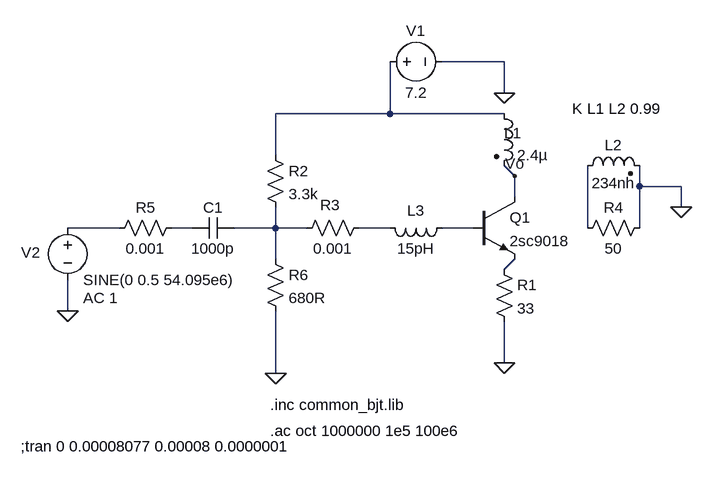
[diagram p0: schematic 27Mhz-class A.asc]
27Mhz-class A.asc, the LTspice schematic file:
Version 4
SHEET 1 880 680
WIRE 368 -112 272 -112
WIRE 368 -64 368 -112
WIRE 192 -32 192 -112
WIRE 192 -32 16 -32
WIRE 368 -32 192 -32
WIRE 16 32 16 -32
WIRE 384 64 368 48
WIRE 576 80 576 48
WIRE 640 80 576 80
WIRE 384 96 384 64
WIRE 640 112 640 80
WIRE -224 144 -304 144
WIRE -112 144 -144 144
WIRE 16 144 16 112
WIRE 16 144 -48 144
WIRE 64 144 16 144
WIRE 192 144 144 144
WIRE 320 144 272 144
WIRE 496 144 496 48
WIRE 576 144 576 80
WIRE 16 192 16 144
WIRE 368 208 384 192
WIRE -304 272 -304 224
WIRE 368 352 368 288
WIRE 16 368 16 272
FLAG 368 352 0
FLAG 368 -64 0
FLAG -304 272 0
FLAG 384 64 Vo
FLAG 16 368 0
FLAG 640 112 0
SYMBOL res 352 192 R0
SYMATTR InstName R1
SYMATTR Value 33
SYMATTR SpiceLine tol=1% pwr=1
SYMBOL ind2 352 -48 R0
WINDOW 0 16 46 Left 2
SYMATTR InstName L1
SYMATTR Value 2.4µ
SYMATTR SpiceLine Ipk=1 Rser=0.0478 Rpar=1e4 Cpar=0
SYMATTR Type ind
SYMBOL ind2 480 64 R270
WINDOW 0 32 56 VTop 2
WINDOW 3 5 56 VBottom 2
SYMATTR InstName L2
SYMATTR Value 234nh
SYMATTR SpiceLine Ipk=1 Rser=0.03 Rpar=1e4 Cpar=0.3p
SYMATTR Type ind
SYMBOL npn 320 96 R0
SYMATTR InstName Q1
SYMATTR Value 2sc9018
SYMBOL voltage 176 -112 R270
WINDOW 0 32 56 VTop 2
WINDOW 3 -32 56 VBottom 2
WINDOW 123 0 0 Left 2
WINDOW 39 4 56 VTop 2
SYMATTR InstName V1
SYMATTR Value 7.2
SYMBOL voltage -304 128 R0
WINDOW 123 24 124 Left 2
WINDOW 39 0 0 Left 2
WINDOW 0 -71 54 Left 2
SYMATTR Value2 AC 1
SYMATTR InstName V2
SYMATTR Value SINE(0 0.5 54.095e6)
SYMBOL res 480 160 R270
WINDOW 0 32 56 VTop 2
WINDOW 3 0 56 VBottom 2
SYMATTR InstName R4
SYMATTR Value 50
SYMATTR SpiceLine tol=1% pwr=1
SYMBOL res -240 160 R270
WINDOW 0 32 56 VTop 2
WINDOW 3 0 56 VBottom 2
SYMATTR InstName R5
SYMATTR Value 0.001
SYMATTR SpiceLine tol=1% pwr=1
SYMBOL res 0 176 R0
SYMATTR InstName R6
SYMATTR Value 680R
SYMBOL res 0 16 R0
SYMATTR InstName R2
SYMATTR Value 3.3k
SYMATTR SpiceLine tol=1% pwr=1
SYMBOL cap -48 160 M270
WINDOW 0 32 32 VTop 2
WINDOW 3 0 32 VBottom 2
SYMATTR InstName C1
SYMATTR Value 1000p
SYMBOL res 160 128 R90
WINDOW 0 -4 60 VBottom 2
WINDOW 3 32 56 VTop 2
SYMATTR InstName R3
SYMATTR Value 0.001
SYMBOL ind 288 128 R90
WINDOW 0 5 56 VBottom 2
WINDOW 3 32 56 VTop 2
SYMATTR InstName L3
SYMATTR Value 15pH
TEXT 8 416 Left 2 !.inc common_bjt.lib
TEXT 8 456 Left 2 !.ac oct 1000000 1e5 100e6
TEXT 472 -40 Left 2 !K L1 L2 0.99
TEXT -376 480 Left 2 !;tran 0 0.00008077 0.00008 0.0000001

The netlist it stands for:
* 27Mhz-class A.asc
R1 N008 0 33 tol=1% pwr=1
L1 N001 Vo 2.4µ Ipk=1 Rser=0.0478 Rpar=1e4 Cpar=0
L2 N007 0 234nh Ipk=1 Rser=0.03 Rpar=1e4 Cpar=0.3p
Q1 Vo N006 N008 0 2sc9018
V1 N001 0 7.2
V2 N002 0 SINE(0 0.5 54.095e6) AC 1
R4 N007 0 50 tol=1% pwr=1
R5 N002 N003 0.001 tol=1% pwr=1
R6 N004 0 680R
R2 N001 N004 3.3k tol=1% pwr=1
C1 N004 N003 1000p
R3 N005 N004 0.001
L3 N006 N005 15pH
.model NPN NPN
.model PNP PNP
.lib standard.bjt
.inc common_bjt.lib
.ac oct 1000000 1e5 100e6
K L1 L2 0.99
;tran 0 0.00008077 0.00008 0.0000001
.backanno
.end